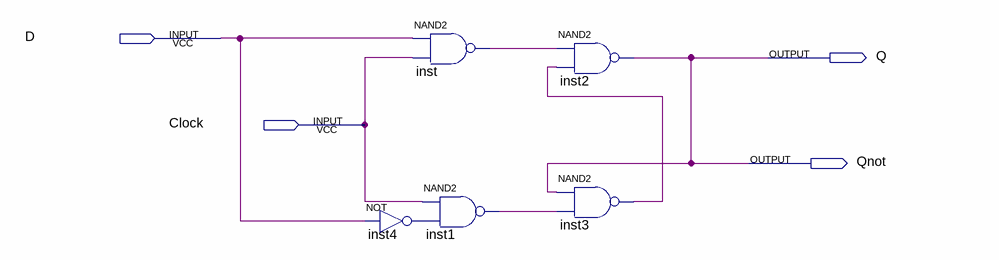
[diagram p0: schematic sheet]
// Quartus schematic myDff.bdf as structural Verilog: 5 symbols, 4 pins
module myDff (
  input  D,
  input  Clock,
  output Q,
  output Qnot
);

  wire inst1_out, inst3_out, inst4_out, inst_out;

  nand inst (inst_out, D, Clock);
  nand inst1 (inst1_out, Clock, inst4_out);
  not inst4 (inst4_out, D);
  nand inst2 (Q, inst_out, inst3_out);
  nand inst3 (inst3_out, Q, inst1_out);

  assign Qnot = Q;
endmodule
